# Altium project FPS_Anzeige_V2.PrjPcb
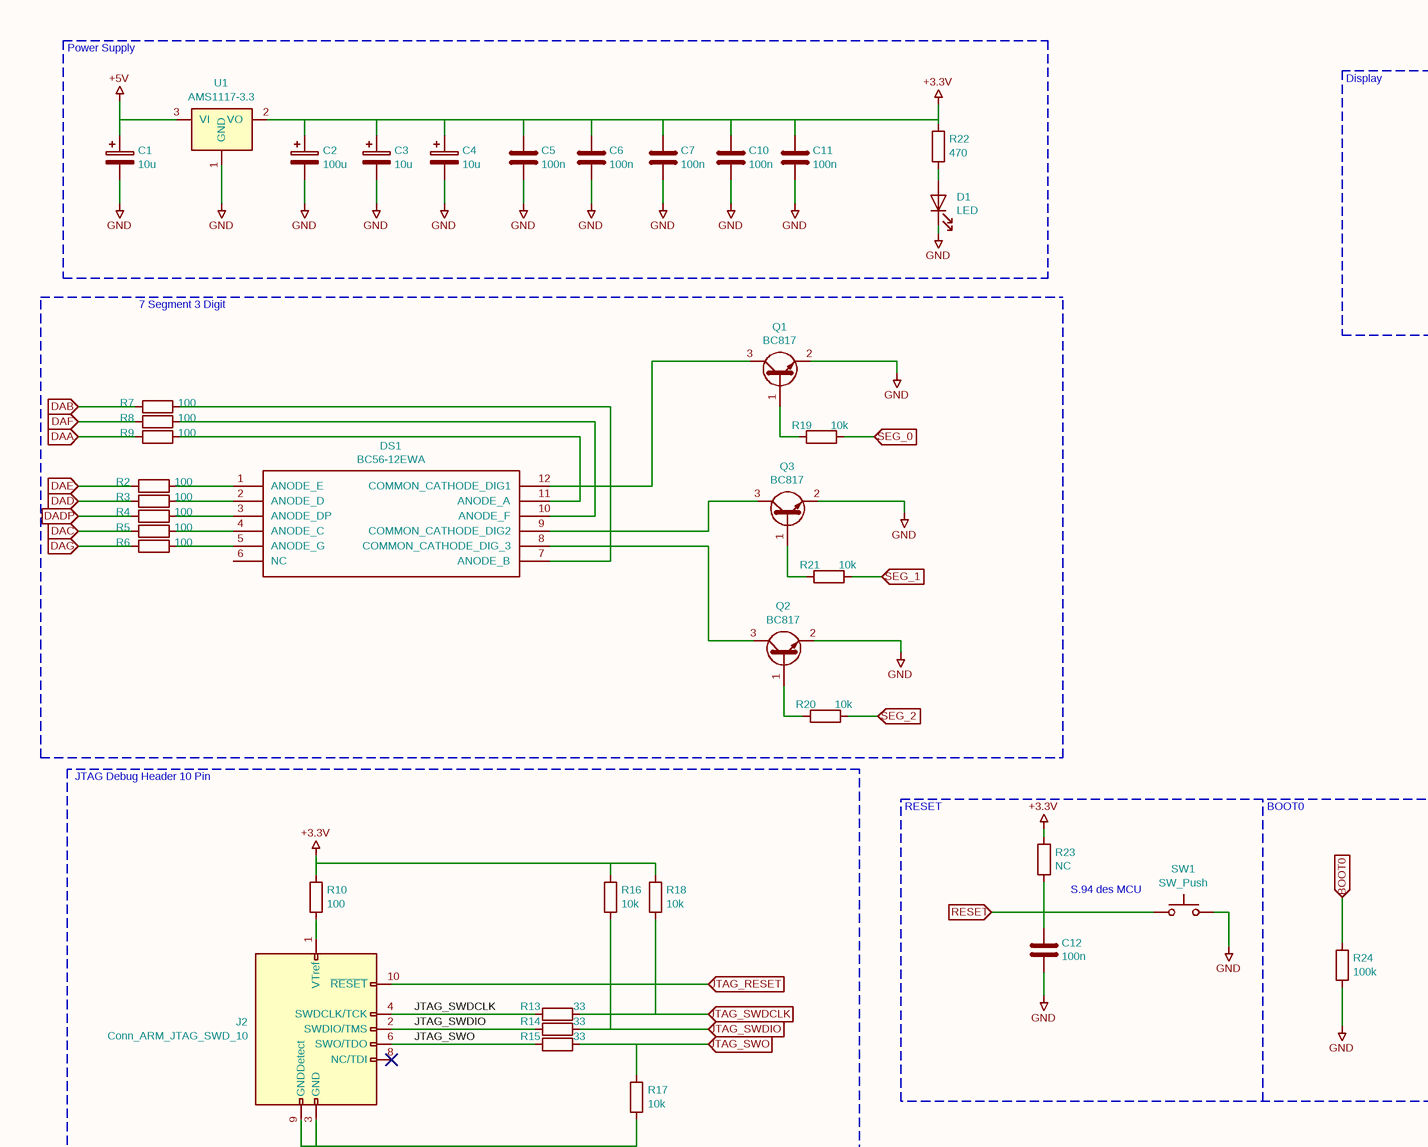
[diagram p0: FPS_Anzeige_V2.SchDoc, top left]
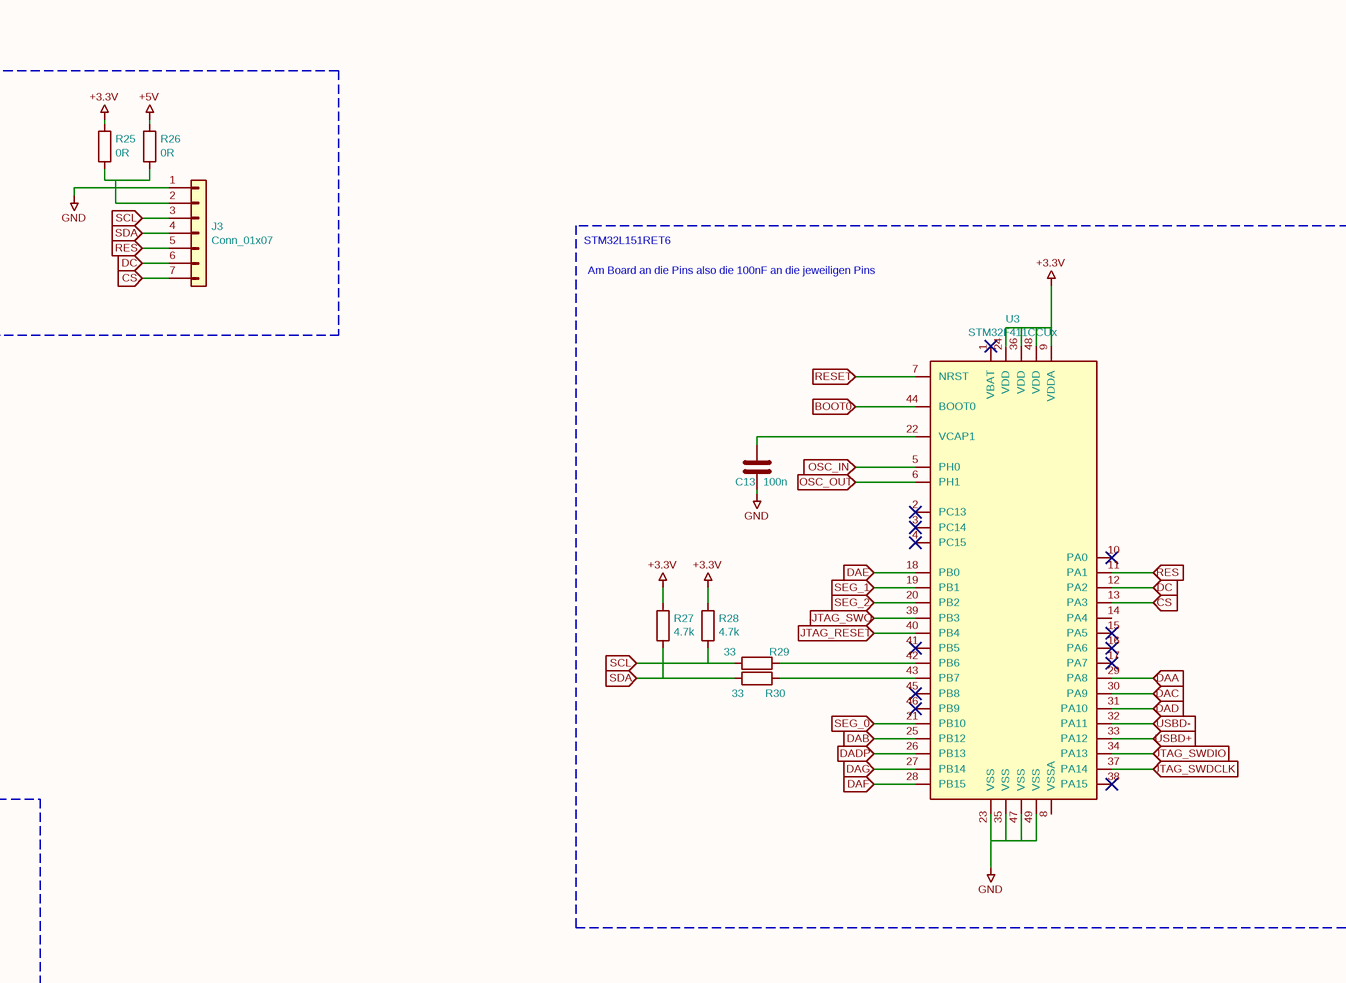
[diagram p1: FPS_Anzeige_V2.SchDoc, top right]
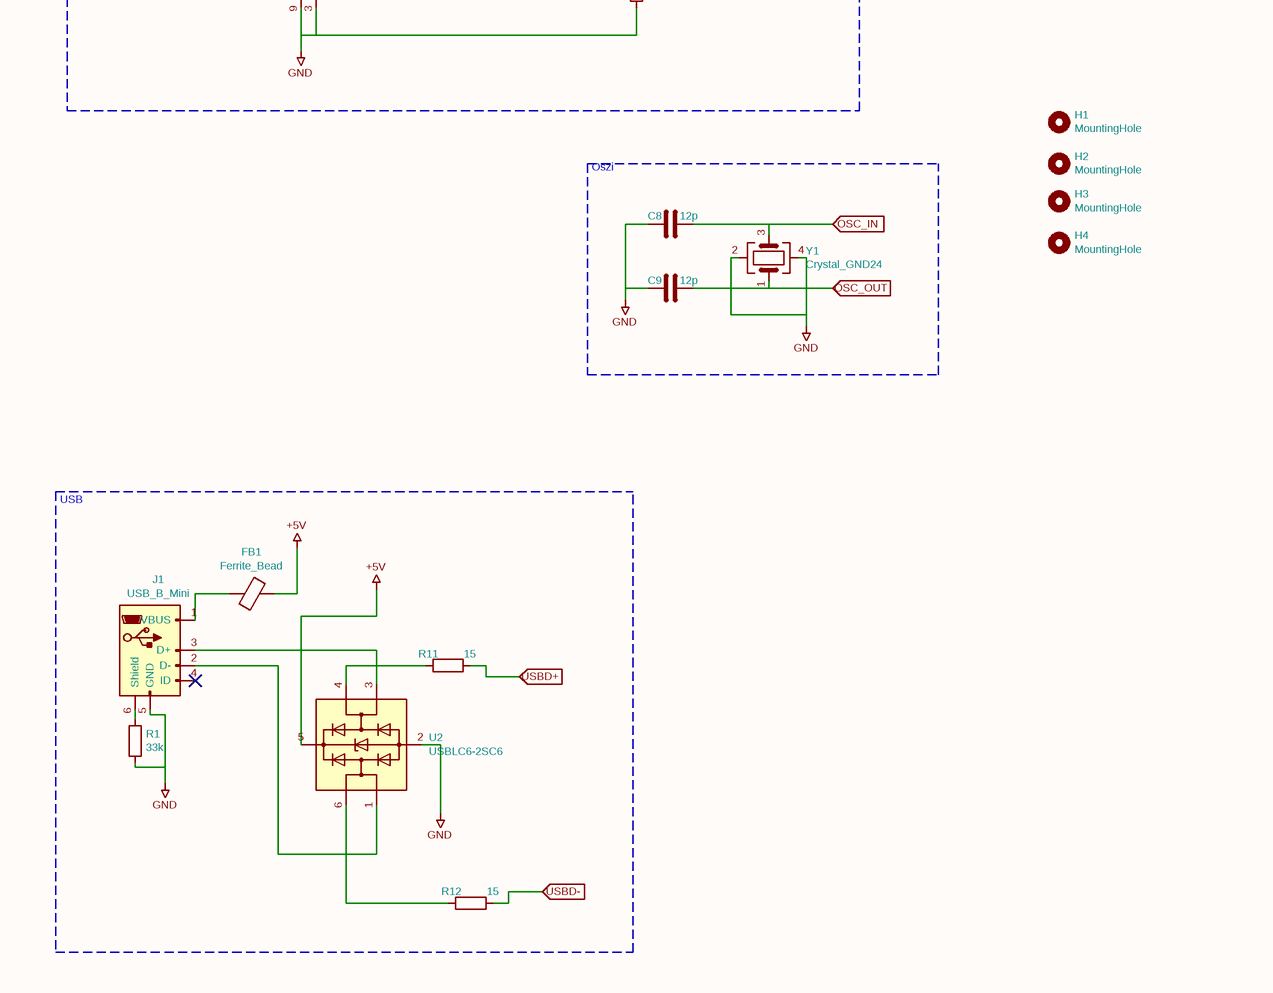
[diagram p2: FPS_Anzeige_V2.SchDoc, bottom left]
1 sheet, 61 parts. Net scope: flat (ports and power ports of the same name join across sheets).
Board file: FPS_Anzeige_V2.PcbDoc

## Sheet FPS_Anzeige_V2.SchDoc
size 594 x 419 mm

### Parts
C1  10u  [CP_Elec_4x4.5]
C2  100u  [CP_Elec_5x5.3]
C3  10u  [CP_Elec_4x4.5]
C4  10u  [CP_Elec_4x4.5]
C5  100n  [C_0805_2012Metric_Pad1.18x1.45mm_HandSolder]
C6  100n  [C_0805_2012Metric_Pad1.18x1.45mm_HandSolder]
C7  100n  [C_0805_2012Metric_Pad1.18x1.45mm_HandSolder]
C8  12p  [C_0805_2012Metric_Pad1.18x1.45mm_HandSolder]
C9  12p  [C_0805_2012Metric_Pad1.18x1.45mm_HandSolder]
C10  100n  [C_0805_2012Metric_Pad1.18x1.45mm_HandSolder]
C11  100n  [C_0805_2012Metric_Pad1.18x1.45mm_HandSolder]
C12  100n  [C_0805_2012Metric_Pad1.18x1.45mm_HandSolder]
C13  100n  [C_0805_2012Metric_Pad1.18x1.45mm_HandSolder]
D1  LED  [LED_0805_2012Metric]
DS1  BC56-12EWA  [DIPS1524W50P254L3760H835Q12N]
FB1  Ferrite_Bead  [R_0805_2012Metric]
H1  MountingHole  [MountingHole_3.2mm_M3_DIN965]
H2  MountingHole  [MountingHole_3.2mm_M3_DIN965]
H3  MountingHole  [MountingHole_3.2mm_M3_DIN965]
H4  MountingHole  [MountingHole_3.2mm_M3_DIN965]
J1  USB_B_Mini  [USB_Mini-B_Wuerth_65100516121_Horizontal]
J2  Conn_ARM_JTAG_SWD_10  [PinHeader_2x05_P1.27mm_Vertical]
J3  Conn_01x07  [PinHeader_1x07_P2.54mm_Vertical]
Q1  BC817  [SOT-23]
Q2  BC817  [SOT-23]
Q3  BC817  [SOT-23]
R1  33k  [R_0805_2012Metric]
R2  100  [R_0805_2012Metric]
R3  100  [R_0805_2012Metric]
R4  100  [R_0805_2012Metric]
R5  100  [R_0805_2012Metric]
R6  100  [R_0805_2012Metric]
R7  100  [R_0805_2012Metric]
R8  100  [R_0805_2012Metric]
R9  100  [R_0805_2012Metric]
R10  100  [R_0805_2012Metric]
R11  15  [R_0805_2012Metric]
R12  15  [R_0805_2012Metric]
R13  33  [R_0805_2012Metric]
R14  33  [R_0805_2012Metric]
R15  33  [R_0805_2012Metric]
R16  10k  [R_0805_2012Metric]
R17  10k  [R_0805_2012Metric]
R18  10k  [R_0805_2012Metric]
R19  10k  [R_0805_2012Metric]
R20  10k  [R_0805_2012Metric]
R21  10k  [R_0805_2012Metric]
R22  470  [R_0805_2012Metric]
R23  NC  [R_0805_2012Metric]
R24  100k  [R_0805_2012Metric]
R25  0R  [R_0805_2012Metric]
R26  0R  [R_0805_2012Metric]
R27  4.7k  [R_0805_2012Metric]
R28  4.7k  [R_0805_2012Metric]
R29  33  [R_0805_2012Metric]
R30  33  [R_0805_2012Metric]
SW1  SW_Push  [SW_Push_1P1T_NO_6x6mm_H9.5mm]
U1  AMS1117-3.3  [SOT-223-3_TabPin2]
U2  USBLC6-2SC6  [SOT-23-6]
U3  STM32F411CCUx  [QFN-48-1EP_7x7mm_P0.5mm_EP5.6x5.6mm]
Y1  Crystal_GND24  [Crystal_SMD_3225-4Pin_3.2x2.5mm]

### Blocks framed on the sheet
Power Supply: C1-C7 C10 C11 D1 R22 U1
Display: J3 R25 R26
7 Segment 3 Digit: DS1 Q1-Q3 R2-R9 R19-R21
JTAG Debug Header 10 Pin: J2 R10 R13-R18
Oszi: C8 C9 Y1
USB: FB1 J1 R1 R11 R12 U2

### Ports
BOOT0 (in), CS (in), DAA (in), DAB (in), DAC (in), DAD (in), DADP (in), DAE (in), DAF (in), DAG (in), DC (in), JTAG_RESET (in), JTAG_SWDCLK (in), JTAG_SWDIO (in), JTAG_SWO (in), OSC_IN (in), OSC_OUT (in), RES (in), RESET (in), SCL (in), SDA (in), SEG_0 (in), SEG_1 (in), SEG_2 (in), USBD+ (in), USBD- (in)

### Nets
+3.3V: C2.1 C3.1 C4.1 C5.1 C6.1 C7.1 C10.1 C11.1 R10.1 R16.1 R18.1 R22.1 R23.1 R25.1 R27.1 R28.1 U1.2(VO) U3.9(VDDA) U3.24(VDD) U3.36(VDD) U3.48(VDD)
+5V: C1.1 FB1.1 R26.1 U1.3(VI) U2.5(VBUS)
GND: C1.2 C2.2 C3.2 C4.2 C5.2 C6.2 C7.2 C8.2 C9.2 C10.2 C11.2 C12.2 C13.2 D1.1(K) J1.5(GND) J2.3(GND) J2.9(GNDDetect) J3.1(Pin_1) Q1.2(E) Q2.2(E) Q3.2(E) R1.2 R17.2 R24.2 SW1.2 U1.1(GND) U2.2(GND) U3.23(VSS) U3.35(VSS) U3.47(VSS) U3.49(VSS) Y1.2 Y1.4
BOOT0: R24.1 U3.44(BOOT0) ; port BOOT0
CS: J3.7(Pin_7) U3.13(PA3) ; port CS
DAA: R9.2 U3.29(PA8) ; port DAA
DAB: R7.2 U3.25(PB12) ; port DAB
DAC: R5.2 U3.30(PA9) ; port DAC
DAD: R3.2 U3.31(PA10) ; port DAD
DADP: R4.2 U3.26(PB13) ; port DADP
DAE: R2.2 U3.18(PB0) ; port DAE
DAF: R8.2 U3.28(PB15) ; port DAF
DAG: R6.2 U3.27(PB14) ; port DAG
DC: J3.6(Pin_6) U3.12(PA2) ; port DC
JTAG_RESET: J2.10(~{RESET}) U3.40(PB4) ; port JTAG_RESET
JTAG_SWDCLK: J2.4(SWDCLK/TCK) R13.2
JTAG_SWDCLK: R13.1 R18.2 U3.37(PA14) ; port JTAG_SWDCLK  [a separate net that carries the same name]
JTAG_SWDIO: J2.2(SWDIO/TMS) R14.2
JTAG_SWDIO: R14.1 R16.2 U3.34(PA13) ; port JTAG_SWDIO  [a separate net that carries the same name]
JTAG_SWO: J2.6(SWO/TDO) R15.2
JTAG_SWO: R15.1 R17.1 U3.39(PB3) ; port JTAG_SWO  [a separate net that carries the same name]
OSC_IN: C8.1 U3.5(PH0) Y1.3 ; port OSC_IN
OSC_OUT: C9.1 U3.6(PH1) Y1.1 ; port OSC_OUT
RES: J3.5(Pin_5) U3.11(PA1) ; port RES
RESET: C12.1 R23.2 SW1.1 U3.7(NRST) ; port RESET
SCL: J3.3(Pin_3) R28.2 R29.1 ; port SCL
SDA: J3.4(Pin_4) R27.2 R30.1 ; port SDA
SEG_0: R19.1 U3.21(PB10) ; port SEG_0
SEG_1: R21.1 U3.19(PB1) ; port SEG_1
SEG_2: R20.1 U3.20(PB2) ; port SEG_2
USBD+: R11.1 U3.33(PA12) ; port USBD+
USBD-: R12.1 U3.32(PA11) ; port USBD-
NetC13_1: C13.1 U3.22(VCAP1)
NetD1_2: D1.2(A) R22.2
NetDS1_1: DS1.1(ANODE_E) R2.1
NetDS1_2: DS1.2(ANODE_D) R3.1
NetDS1_3: DS1.3(ANODE_DP) R4.1
NetDS1_4: DS1.4(ANODE_C) R5.1
NetDS1_5: DS1.5(ANODE_G) R6.1
NetDS1_7: DS1.7(ANODE_B) R7.1
NetDS1_8: DS1.8(COMMON_CATHODE_DIG_3) Q2.3(C)
NetDS1_9: DS1.9(COMMON_CATHODE_DIG2) Q3.3(C)
NetDS1_10: DS1.10(ANODE_F) R8.1
NetDS1_11: DS1.11(ANODE_A) R9.1
NetDS1_12: DS1.12(COMMON_CATHODE_DIG1) Q1.3(C)
NetFB1_2: FB1.2 J1.1(VBUS)
NetJ1_2: J1.2(D-) U2.1(I/O1)
NetJ1_3: J1.3(D+) U2.3(I/O2)
NetJ1_6: J1.6(Shield) R1.1
NetJ2_1: J2.1(VTref) R10.2
NetJ3_2: J3.2(Pin_2) R25.2 R26.2
NetQ1_1: Q1.1(B) R19.2
NetQ2_1: Q2.1(B) R20.2
NetQ3_1: Q3.1(B) R21.2
NetR11_2: R11.2 U2.4(I/O2)
NetR12_2: R12.2 U2.6(I/O1)
NetR29_2: R29.2 U3.42(PB6)
NetR30_2: R30.2 U3.43(PB7)

Not connected (* = marked no-connect by the designer): DS1 6(NC); J1 4(ID)*; J2 5(GND) 7(KEY) 8(NC/TDI)*; U3 1(VBAT)* 2(PC13)* 3(PC14)* 4(PC15)* 8(VSSA) 10(PA0)* 14(PA4) 15(PA5)* 16(PA6)* 17(PA7)* 38(PA15)* 41(PB5)* 45(PB8)* 46(PB9)*

### Notes on the sheet
- STM32L151RET6
- Am Board an die Pins also die 100nF an die jeweiligen Pins
- RESET
- BOOT0
- S.94 des MCU
- 1
- 2
- 3
- 4
- 5
- 6
- 7
- 8
- 9
- 10
- 11
- A
- B
- C
- D
- E
- F
- G
- H
- Kraus Anton
- Prillwitz Robin
- Title: FPS_Anzeige_V2
- File: FPS_Anzeige_V2.sch
- Sheet: /
- KiCad E.D.A.  kicad (5.1.4)-1
- Size: A4
- Date: 2021-04-21
- Rev:
- Id: 1/1

### Library data of the parts
C1 C3 C4 = CP: MFN: VSS100M1CTR-0404; Value: 10u; Footprint: Capacitor_SMD:CP_Elec_4x4.5
C2 = CP: MFN: VE-101M1ATR-0505; Value: 100u; Footprint: Capacitor_SMD:CP_Elec_5x5.3
C5-C7 C10-C13 = C: MFN: LMK212SD104KG-T; Value: 100n; Footprint: Capacitor_SMD:C_0805_2012Metric_Pad1.18x1.45mm_HandSolder
C8 C9 = C: MFN: 0805CG120J500NT; Value: 12p; Footprint: Capacitor_SMD:C_0805_2012Metric_Pad1.18x1.45mm_HandSolder
D1 = LED: MFN: 17-21SYGC/S530-E2/TR8; Value: LED; Footprint: LED_SMD:LED_0805_2012Metric
DS1 = BC56-12EWA: Manufacturer_Name: Kingbright; Description: LED Displays & Accessories Tri Red 625nm Common Cathode; Height: 8.35; Mouser Part Number: 604-BC56-12EWA; Mouser Price/Stock: https://www.mouser.co.uk/ProductDetail/Kingbright/BC56-12EWA?qs=VdjlWU%2FzoOFYzPvg24W7QQ%3D%3D; Manufacturer_Part_Number: BC56-12EWA; MFN: BC56-12EWA; Value: BC56-12EWA; Footprint: SamacSys_Parts:DIPS1524W50P254L3760H835Q12N
FB1 = Ferrite_Bead: MFN: CBW201209U601T; Value: Ferrite_Bead; Footprint: Resistor_SMD:R_0805_2012Metric
Q1-Q3 = BC817: MFN: KBC81740C; Value: BC817; Footprint: Package_TO_SOT_SMD:SOT-23
R1 = R: MFN: RS-05K3302FT; Value: 33k; Footprint: Resistor_SMD:R_0805_2012Metric
R2-R10 = R: MFN: 0805W8J0101T5E; Value: 100; Footprint: Resistor_SMD:R_0805_2012Metric
R11 R12 = R: MFN: RTT05150JTP; Value: 15; Footprint: Resistor_SMD:R_0805_2012Metric
R13-R15 R29 R30 = R: MFN: 0805W8J0330T5E; Value: 33; Footprint: Resistor_SMD:R_0805_2012Metric
R16-R21 = R: MFN: 0805W8J0103T5E; Value: 10k; Footprint: Resistor_SMD:R_0805_2012Metric
R22 = R: MFN: 0805W8J0471T5E; Value: 470; Footprint: Resistor_SMD:R_0805_2012Metric
R23 = R: Value: NC; Footprint: Resistor_SMD:R_0805_2012Metric
R24 = R: MFN: RS-05K104JT; Value: 100k; Footprint: Resistor_SMD:R_0805_2012Metric
R25 R26 = R: MFN: 0805W8F0000T5E; Value: 0R; Footprint: Resistor_SMD:R_0805_2012Metric
R27 R28 = R: MFN: 0805W8J0472T5E; Value: 4.7k; Footprint: Resistor_SMD:R_0805_2012Metric
U3 = STM32F411CCUx: MFN: STM32F411CCU6TR; Value: STM32F411CCUx; Footprint: Package_DFN_QFN:QFN-48-1EP_7x7mm_P0.5mm_EP5.6x5.6mm
Y1 = Crystal_GND24: MFN: SX32Y024000BC1T; Value: Crystal_GND24; Footprint: Crystal:Crystal_SMD_3225-4Pin_3.2x2.5mm
H1-H4 = MountingHole: Value: MountingHole; Footprint: MountingHole:MountingHole_3.2mm_M3_DIN965
J1 = USB_B_Mini: Value: USB_B_Mini; Footprint: Connector_USB:USB_Mini-B_Wuerth_65100516121_Horizontal
J2 = Conn_ARM_JTAG_SWD_10: Value: Conn_ARM_JTAG_SWD_10; Footprint: Connector_PinHeader_1.27mm:PinHeader_2x05_P1.27mm_Vertical
J3 = Conn_01x07: Value: Conn_01x07; Footprint: Connector_PinHeader_2.54mm:PinHeader_1x07_P2.54mm_Vertical
SW1 = SW_Push: Value: SW_Push; Footprint: Button_Switch_SMD:SW_Push_1P1T_NO_6x6mm_H9.5mm
U1 = AMS1117-3.3: MFN: AMS1117-3.3; Value: AMS1117-3.3; Footprint: Package_TO_SOT_SMD:SOT-223-3_TabPin2
U2 = USBLC6-2SC6: MFN: USBLC6-2SC6; Value: USBLC6-2SC6; Footprint: Package_TO_SOT_SMD:SOT-23-6